# EAGLE schematic Nusbio.smd (EAGLE 7.2.0)
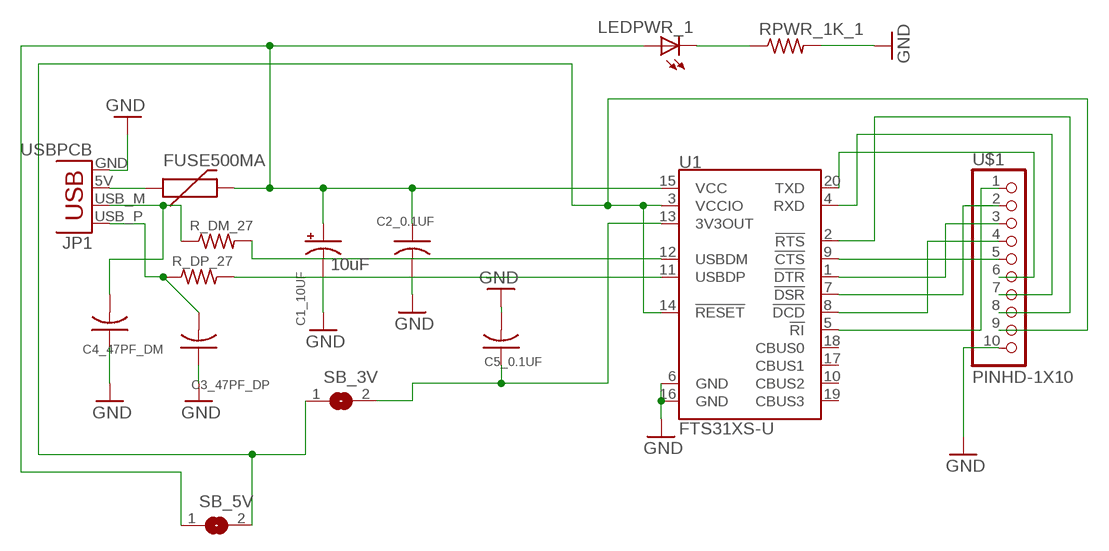
[diagram p0: schematic, sheet 1]

## Parts
C1_10UF  10uF  10UF-16V-10%(TANT)  [EIA3216]
C2_0.1UF  C-USC1206  [C1206]
C3_47PF_DP  C-USC1206  [C1206]
C4_47PF_DM  C-USC1206  [C1206]
C5_0.1UF  C-USC1206  [C1206]
FUSE500MA  PTCSMD  [PTC-1206]
JP1  USBPCB  [USB-A-PCB]
LEDPWR_1  LEDCHIPLED_0805  [CHIPLED_0805]
R_DM_27  R-US_R0805  [R0805]
R_DP_27  R-US_R0805  [R0805]
RPWR_1K_1  R-US_R0805  [R0805]
SB_3V  SOLDERJUMPERREFLOW  [SOLDERJUMPER_REFLOW]
SB_5V  SOLDERJUMPERREFLOW  [SOLDERJUMPER_REFLOW]
U1  FTS31XS-U  FT231XS  [SSOP20_L]
U$1  PINHD-1X10  [1X10-BIG]

## Nets
GND: C1_10UF.C(-) C2_0.1UF.2 C3_47PF_DP.1 C4_47PF_DM.1 C5_0.1UF.2 JP1.GND RPWR_1K_1.2 U1.6(GND) U1.16(GND) U$1.10
N$1: FUSE500MA.1 JP1.5V(VBUS)
N$2: C5_0.1UF.1 SB_3V.2 U1.13(3V3OUT)
N$3: LEDPWR_1.C RPWR_1K_1.1
N$4: R_DM_27.2 U1.12(USBDM)
N$5: R_DP_27.2 U1.11(USBDP)
N$6: U1.20(TXD) U$1.6
N$7: U1.7(!DSR) U$1.2
N$8: U1.5(!RI) U$1.1
N$9: U1.1(!DTR) U$1.3
N$10: U1.8(!DCD) U$1.4
N$11: U1.9(!CTS) U$1.5
N$12: U1.4(RXD) U$1.7
N$13: U1.2(!RTS) U$1.8
N$14: SB_3V.1 SB_5V.2 U1.3(VCCIO) U1.14(!RESET) U$1.9
N$15: C3_47PF_DP.2 JP1.USB_P(D+) R_DP_27.1
N$16: C4_47PF_DM.2 JP1.USB_M(D-) R_DM_27.1
N$17: C1_10UF.A(+) C2_0.1UF.1 FUSE500MA.2 LEDPWR_1.A SB_5V.1 U1.15(VCC)
Unconnected: U1.10(CBUS2) U1.17(CBUS1) U1.18(CBUS0) U1.19(CBUS3)

## Library data of the parts
C1_10UF = SparkFun-Capacitors:10UF-16V-10%(TANT): CAP-00811 1206/EIA-3216 Tantalum capacitor; PROD_ID: CAP-00811
C2_0.1UF C3_47PF_DP C4_47PF_DM C5_0.1UF = adafruit:C-US: CAPACITOR, American symbol
FUSE500MA = SparkFun-PowerIC:PTC: Resettable Fuse PTC Resettable Fuse. Spark Fun Electronics SKU : COM-08357; PROD_ID: RES-11150
JP1 = SparkFun-Connectors:USB: USB Connectors USB-B-PTH is fully proven SKU : PRT-00139/CONN-08278 USB-miniB is fully proven SKU : PRT-00587 USB-A-PCB is untested. USB-A-H is throughly reviewed, but untested. Spark Fun Electronics SKU : PRT-00437 USB-B-SMT is throughly reviewed, but untested. Needs silkscreen touching up. USB-A-S has not been used/tested USB-MB-H has not been used/tested USB-MICROB has been used. CONN-09505
LEDPWR_1 = adafruit:LED: LED OSRAM: - CHIPLED LG R971, LG N971, LY N971, LG Q971, LY Q971, LO R971, LY R971 LH N974, LH R974 LS Q976, LO Q976, LY Q976 LO Q996 - Hyper CHIPLED LW Q18S LB Q993, LB Q99A, LB R99A - SideLED LS A670, LO A670, LY A670, LG A670, LP A670 LB A673, LV A673, LT A673, LW A673 LH A674 LY A675 LS A676, LA A676, LO A676, LY A676, LW A676 LS A679, LY A679, LG A679 - Hyper Micro SIDELED® LS Y876, LA Y876, LO Y876, LY Y876 LT Y87S - SmartLED LW L88C, LW L88S LB L89C, LB L89S, LG L890 LS L89K, LO L89K, LY L89K LS L896, LA L896, LO L896, LY L896 - TOPLED LS T670, LO T670, LY T670, LG T670, LP T670 LSG T670, LSP T670, LSY T670, LOP T670, LYG T670 LG T671, LOG T671, LSG T671 LB T673, LV T673, LT T673, LW T673 LH T674 LS T676, LA T676, LO T676, LY T676, LB T676, LH T676, LSB T676, LW T676 LB T67C, LV T67C, LT T67C, LS T67K, LO T67K, LY T67K, LW E67C LS E67B, LA E67B, LO E67B, LY E67B, LB E67C, LV E67C, LT E67C LW T67C LS T679, LY T679, LG T679 LS T770, LO T770, LY T770, LG T770, LP T770 LB T773, LV T773, LT T773, LW T773 LH T774 LS E675, LA E675, LY E675, LS T675 LS T776, LA T776, LO T776, LY T776, LB T776 LHGB T686 LT T68C, LB T68C - Hyper Mini TOPLED® LB M676 - Mini TOPLED Santana® LG M470 LS M47K, LO M47K, LY M47K Source: http://www.osram.convergy.de/
R_DM_27 R_DP_27 RPWR_1K_1 = adafruit:R-US_: RESISTOR, American symbol
SB_3V SB_5V = microbuilder:SOLDERJUMPER: SMD Solder JUMPER Solder the two pads together to create a connection, or remove the solder to break it. REFLOW - Use this footprint for solder paste and reflow ovens. WAVE - Use this footprint for hand-soldering (larger pads). CLOSED - Has a trace between the two pads to ensure it is closed by default. The trace needs to be cut to disable the jumper, and can be closed again by creating a solder bridge between the two pads.
U1 = SparkFun-DigitalIC:FT231X: FTDI FT231X Full Speed USB to Full-handshake UART This USB2.0 Full Speed IC offers a compact bridge to full handshake UART interfaces. The device is a UART, capable of operating up to 3MBaud, with low power consumption (8mA). The FT231X includes the complete FT-X series feature set and enables USB to be added into a system design quickly and easily over a UART interface.; PROD_ID: IC-11524
U$1 = adafruit:PINHD-1X10: Pin header 1x10 0.1" spacing With round pins